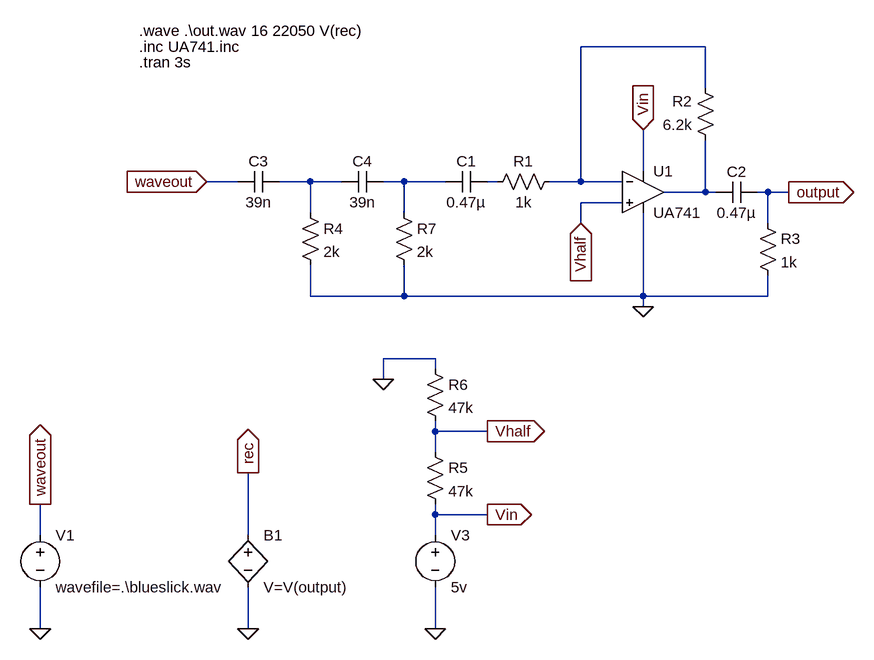
[diagram p0: schematic High-pass Filter.asc]
High-pass Filter.asc, the LTspice schematic file:
Version 4
SHEET 1 1324 680
WIRE -1600 -592 -1792 -592
WIRE -1600 -528 -1600 -592
WIRE -1696 -400 -1696 -464
WIRE -2320 -384 -2368 -384
WIRE -2208 -384 -2256 -384
WIRE -2160 -384 -2208 -384
WIRE -2064 -384 -2096 -384
WIRE -2000 -384 -2064 -384
WIRE -1920 -384 -1936 -384
WIRE -1792 -384 -1792 -592
WIRE -1792 -384 -1840 -384
WIRE -1728 -384 -1792 -384
WIRE -1600 -368 -1600 -448
WIRE -1600 -368 -1664 -368
WIRE -1584 -368 -1600 -368
WIRE -1504 -368 -1520 -368
WIRE -1472 -368 -1504 -368
WIRE -1728 -352 -1792 -352
WIRE -2208 -336 -2208 -384
WIRE -2064 -336 -2064 -384
WIRE -1792 -320 -1792 -352
WIRE -1504 -320 -1504 -368
WIRE -2208 -208 -2208 -256
WIRE -2064 -208 -2064 -256
WIRE -2064 -208 -2208 -208
WIRE -1696 -208 -1696 -336
WIRE -1696 -208 -2064 -208
WIRE -1504 -208 -1504 -240
WIRE -1504 -208 -1696 -208
WIRE -1696 -192 -1696 -208
WIRE -2016 -112 -2096 -112
WIRE -2016 -96 -2016 -112
WIRE -2096 -80 -2096 -112
WIRE -2016 0 -2016 -16
WIRE -1936 0 -2016 0
WIRE -2016 32 -2016 0
WIRE -2016 128 -2016 112
WIRE -1936 128 -2016 128
WIRE -2624 160 -2624 112
WIRE -2304 160 -2304 64
WIRE -2016 160 -2016 128
WIRE -2624 304 -2624 240
WIRE -2304 304 -2304 240
WIRE -2016 304 -2016 240
FLAG -2624 304 0
FLAG -2624 112 waveout
IOPIN -2624 112 Out
FLAG -2368 -384 waveout
IOPIN -2368 -384 In
FLAG -1472 -368 output
IOPIN -1472 -368 Out
FLAG -2304 304 0
FLAG -2304 64 rec
IOPIN -2304 64 Out
FLAG -1696 -464 Vin
IOPIN -1696 -464 In
FLAG -2016 304 0
FLAG -1936 128 Vin
IOPIN -1936 128 Out
FLAG -2096 -80 0
FLAG -1936 0 Vhalf
IOPIN -1936 0 Out
FLAG -1792 -320 Vhalf
IOPIN -1792 -320 In
FLAG -1696 -192 0
SYMBOL voltage -2624 144 R0
SYMATTR InstName V1
SYMATTR Value wavefile=.\blueslick.wav
SYMBOL res -1584 -432 R180
WINDOW 0 36 76 Left 2
WINDOW 3 36 40 Left 2
SYMATTR InstName R2
SYMATTR Value 6.2k
SYMATTR SpiceLine tol=1 pwr=0.25
SYMBOL voltage -2016 144 R0
WINDOW 123 0 0 Left 2
WINDOW 39 0 0 Left 2
SYMATTR InstName V3
SYMATTR Value 5v
SYMBOL Opamps\\opamp2 -1696 -432 R0
SYMATTR InstName U1
SYMATTR Value UA741
SYMBOL bv -2304 144 R0
SYMATTR InstName B1
SYMATTR Value V=V(output)
SYMBOL res -2032 16 R0
SYMATTR InstName R5
SYMATTR Value 47k
SYMBOL res -2032 -112 R0
SYMATTR InstName R6
SYMATTR Value 47k
SYMBOL res -1824 -400 R90
WINDOW 0 0 56 VBottom 2
WINDOW 3 32 56 VTop 2
SYMATTR InstName R1
SYMATTR Value 1k
SYMBOL cap -1936 -400 R90
WINDOW 0 0 32 VBottom 2
WINDOW 3 32 32 VTop 2
SYMATTR InstName C1
SYMATTR Value 0.47µ
SYMBOL res -1520 -336 R0
SYMATTR InstName R3
SYMATTR Value 1k
SYMBOL cap -1520 -384 R90
WINDOW 0 0 32 VBottom 2
WINDOW 3 32 32 VTop 2
SYMATTR InstName C2
SYMATTR Value 0.47µ
SYMBOL cap -2256 -400 R90
WINDOW 0 0 32 VBottom 2
WINDOW 3 32 32 VTop 2
SYMATTR InstName C3
SYMATTR Value 39n
SYMBOL cap -2096 -400 R90
WINDOW 0 0 32 VBottom 2
WINDOW 3 32 32 VTop 2
SYMATTR InstName C4
SYMATTR Value 39n
SYMBOL res -2224 -352 R0
SYMATTR InstName R4
SYMATTR Value 2k
SYMBOL res -2080 -352 R0
SYMATTR InstName R7
SYMATTR Value 2k
TEXT -2472 -616 Left 2 !.wave .\\out.wav 16 22050 V(rec)
TEXT -2472 -568 Left 2 !.tran 3s
TEXT -2472 -592 Left 2 !.inc UA741.inc

The netlist it stands for:
* High-pass Filter.asc
V1 waveout 0 wavefile=.\blueslick.wav
R2 N005 N001 6.2k tol=1 pwr=0.25
V3 Vin 0 5v
XU1 Vhalf N001 Vin 0 N005 UA741  ; pins In+ In- V+ V- OUT
B1 rec 0 V=V(output)
R5 Vhalf Vin 47k
R6 0 Vhalf 47k
R1 N001 N004 1k
C1 N004 N003 0.47µ
R3 output 0 1k
C2 output N005 0.47µ
C3 N002 waveout 39n
C4 N003 N002 39n
R4 N002 0 2k
R7 N003 0 2k
.wave .\out.wav 16 22050 V(rec)
.tran 3s
.inc UA741.inc
.backanno
.end